# EAGLE design pcb_gift (EAGLE 8.2.2)
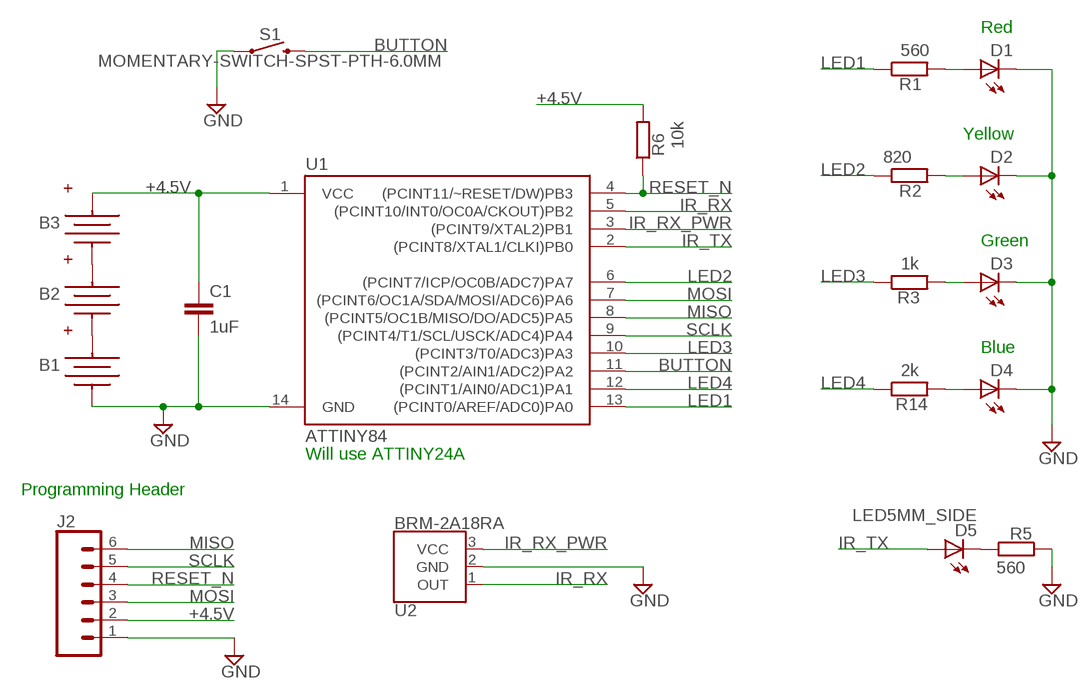
[diagram p0: schematic, sheet 1]

## Parts
B1  KEYSTONE_2996  [KEYSTONE_2996]
B2  KEYSTONE_2996  [KEYSTONE_2996]
B3  KEYSTONE_2996  [KEYSTONE_2996]
C1  1uF  C-EUC0805  [C0805]
D1  LED5MM  [LED5MM]
D2  LED5MM  [LED5MM]
D3  LED5MM  [LED5MM]
D4  LED5MM  [LED5MM]
D5  LED5MM_SIDE  [LED5MM_SIDE]
J2  CONN_061.27MM  [1X06_1.27MM]
R1  560  R-EU_R0805  [R0805]
R2  820  R-EU_R0805  [R0805]
R3  1k  R-EU_R0805  [R0805]
R5  560  R-EU_R0805  [R0805]
R6  10k  R-EU_R0805  [R0805]
R14  2k  R-EU_R0805  [R0805]
S1  MOMENTARY-SWITCH-SPST-PTH-6.0MM  [TACTILE_SWITCH_PTH_6.0MM]
U1  ATTINY84  [SO14]
U2  BRM-2A18RA  [BRM-2508]

## Nets
+4.5V: B3.POSA(POS) B3.POSB(POS) C1.1 J2.2 R6.2 U1.1(VCC)
BUTTON: S1.3 U1.11((PCINT2/AIN1/ADC2)PA2)
GND: B1.NEG C1.2 D1.K(C) D2.K(C) D3.K(C) D4.K(C) J2.1 R5.1 S1.1 U1.14(GND) U2.2(GND)
IR_RX: U1.5((PCINT10/INT0/OC0A/CKOUT)PB2) U2.1(OUT)
IR_RX_PWR: U1.3((PCINT9/XTAL2)PB1) U2.3(VCC)
IR_TX: D5.A U1.2((PCINT8/XTAL1/CLKI)PB0)
LED1: R1.1 U1.13((PCINT0/AREF/ADC0)PA0)
LED2: R2.1 U1.6((PCINT7/ICP/OC0B/ADC7)PA7)
LED3: R3.1 U1.10((PCINT3/T0/ADC3)PA3)
LED4: R14.1 U1.12((PCINT1/AIN0/ADC1)PA1)
MISO: J2.6 U1.8((PCINT5/OC1B/MISO/DO/ADC5)PA5)
MOSI: J2.3 U1.7((PCINT6/OC1A/SDA/MOSI/ADC6)PA6)
N$2: D1.A R1.2
N$3: B1.POSA(POS) B1.POSB(POS) B2.NEG
N$4: B2.POSA(POS) B2.POSB(POS) B3.NEG
N$7: D4.A R14.2
N$10: D3.A R3.2
N$13: D2.A R2.2
N$19: D5.K(C) R5.2
RESET_N: J2.4 R6.1 U1.4((PCINT11/~RESET/DW)PB3)
SCLK: J2.5 U1.9((PCINT4/T1/SCL/USCK/ADC4)PA4)

## Notes on the sheet
- Red
- Yellow
- Green
- Blue
- Will use ATTINY24A
- Programming Header

## Library data of the parts
B1-B3 = widget:KEYSTONE_2996
C1 = resistor:C-EU: CAPACITOR, European symbol
D1-D4 = widget:LED: Generic 5mm LED
D5 = widget:LED5MM_SIDE
J2 = widget:CONN_06: Multi connection point. Often used as Generic Header-pin footprint for 0.1 inch spaced/style header connections On any of the 0.1 inch spaced packages, you can populate with these: Break Away Headers - Straight <https://www.sparkfun.com/products/116> (PRT-00116) Break Away Male Headers - Right Angle <https://www.sparkfun.com/products/553> (PRT-00553) Female Headers <https://www.sparkfun.com/products/115> (PRT-00115) Break Away Headers - Machine Pin <https://www.sparkfun.com/products/117> (PRT-00117) Break Away Female Headers - Swiss Machine Pin <https://www.sparkfun.com/products/743> (PRT-00743) Arduino Stackable Header - 6 Pin <https://www.sparkfun.com/products/9280> (PRT-09280) For SCREWTERMINALS and SPRING TERMINALS visit here: Screw Terimnals on SparkFun.com <https://www.sparkfun.com/search/results?term=Screw+Terminals> (5mm/3.5mm/2.54mm spacing) This device is also useful as a general connection point to wire up your design to another part of your project. Our various solder wires solder well into these plated through hole pads. Hook-Up Wire - Assortment (Stranded, 22 AWG) <https://www.sparkfun.com/products/11375> (PRT-11375) Hook-Up Wire - Assortment (Solid Core, 22 AWG) <https://www.sparkfun.com/products/11367> (PRT-11367) View the entire wire category on our website here <https://www.sparkfun.com/categories/141>
R1-R3 R5 R6 R14 = resistor:R-EU_: RESISTOR, European symbol
S1 = SparkFun-Switches:MOMENTARY-SWITCH-SPST: Momentary Switch (Pushbutton) - SPST Normally-open (NO) SPST momentary switches (buttons, pushbuttons). Variants PTH-12MM - 12mm square, through-hole Momentary Pushbutton Switch - 12mm Square <https://www.sparkfun.com/products/9190> (COM-09190) PTH-6.0MM, PTH-6.0MM-KIT - 6.0mm square, through-hole Mini Pushbutton Switch <https://www.sparkfun.com/products/97> (COM-00097) KIT package intended for soldering kit's - only one side of pads' copper is exposed. PTH-RIGHT-ANGLE-KIT - Right-angle, through-hole Right Angle Tactile Button <https://www.sparkfun.com/products/10791> - Used on SparkFun BigTime Watch Kit <https://www.sparkfun.com/products/11734> SMD-12MM - 12mm square, surface-mount Tactile Button - SMD (12mm) <https://www.sparkfun.com/products/12993> (COM-12993) Used on SparkFun PicoBoard <https://www.sparkfun.com/products/11888> SMD-4.5MM - 4.5mm Square Trackball Switch Used on SparkFun Blackberry Trackballer Breakout <https://www.sparkfun.com/products/13169> SMD-4.6MMX2.8MM - 4.60mm x 2.80mm, surface mount Used on SparkFun SAMD21 Mini Breakout <https://www.sparkfun.com/products/13664> SMD-5.2MM, SMD-5.2-REDUNDANT - 5.2mm square, surface-mount Mini Pushbutton Switch - SMD <https://www.sparkfun.com/products/8720> (COM-08720) Used on Arduino Pro Mini <https://www.sparkfun.com/products/11114> REDUNDANT package connects both switch circuits together SMD-6.0X3.5MM - 6.0 x 3.5mm, surface mount Momentary Reset Switch SMD <https://www.sparkfun.com/products/8229> (COM-08229) SMD-6.2MM-TALL - 6.2mm square, surface mount Tactile Button - SMD (6mm) <https://www.sparkfun.com/products/12992> Used on SparkFun Digital Sandbox <https://www.sparkfun.com/products/12651> SMD-RIGHT-ANGLE - Right-angle, surface mount Used on SparkFun Block for Intel® Edison - Arduino <https://www.sparkfun.com/products/13036>; PROD_ID: SWCH-08441; SF_SKU: COM-00097
U1 = widget:ATTINY84: Atmel 14-pin 2/4/8kB flash uC Datasheet <https://cdn.sparkfun.com/datasheets/Widgets/doc8006.pdf> SparkFun Products Tiny AVR Programmer <https://www.sparkfun.com/products/11801> (PGM-11801) SparkFun Servo Trigger - Continuous Rotation <https://www.sparkfun.com/products/13872> (WIG-13872) SparkFun Servo Trigger <https://www.sparkfun.com/products/13118> (WIG-13118); PROD_ID: IC-11285
U2 = widget:BRM-2A18: BRM-2A18 IR Receiver The BRM-2A18 is miniaturized infrared receiver for remote control and other applications requiring improved ambient light rejection. Vertical package is a primary component on the ZX Distance and Gesture Sensor. RA package is not currently in-use. Example Datasheet <http://www.sinoskysun.com/upload/20110512/201105120447164615.PDF> SparkFun Products ZX Distance and Gesture Sensor <https://www.sparkfun.com/products/12780> (COM-12780)

## Board
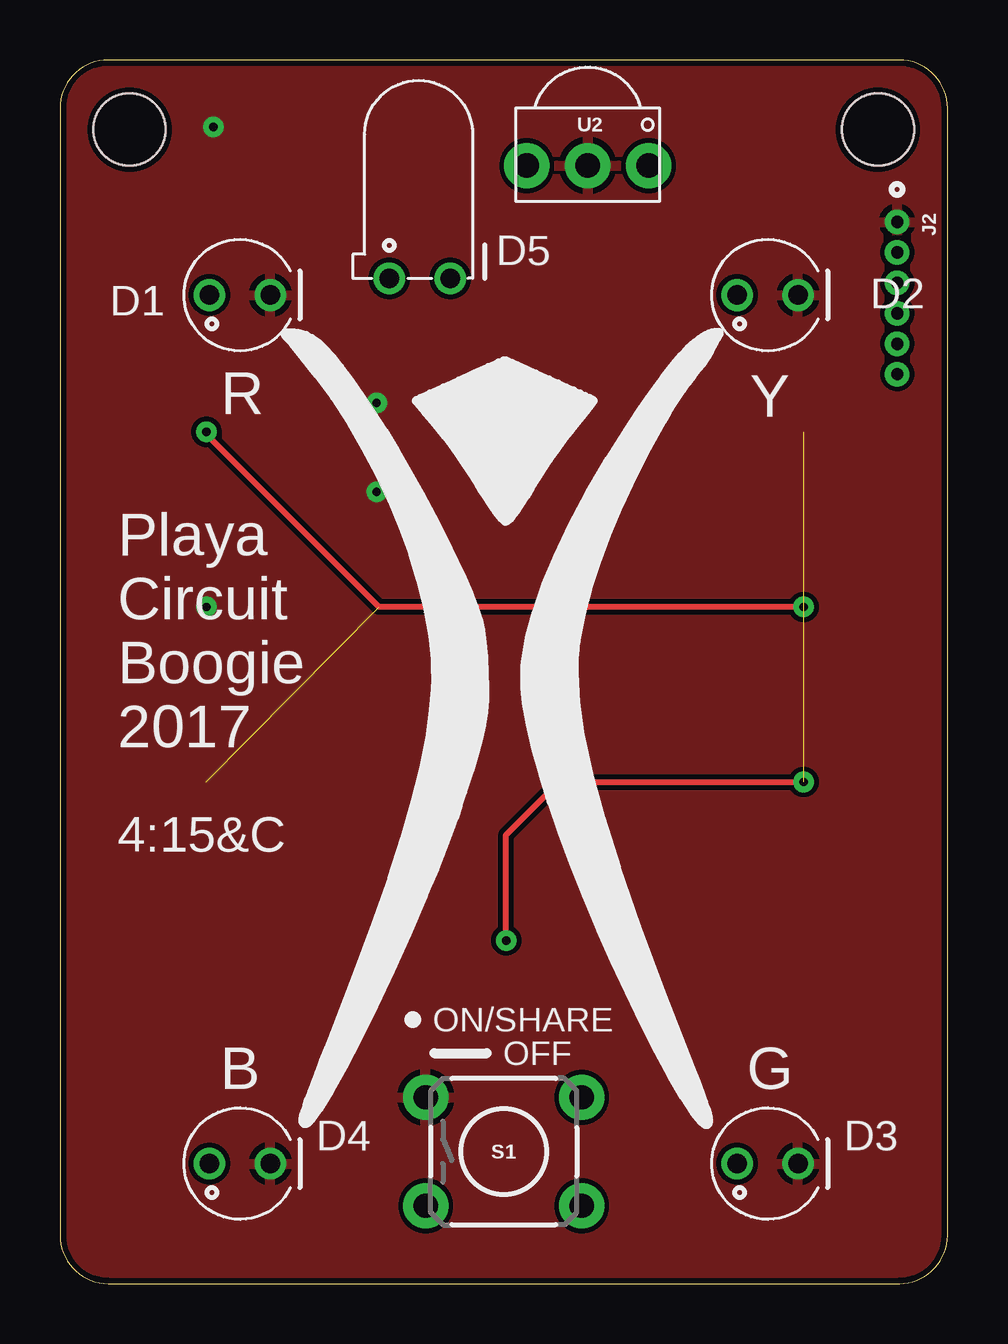
[diagram p1: board, top side]
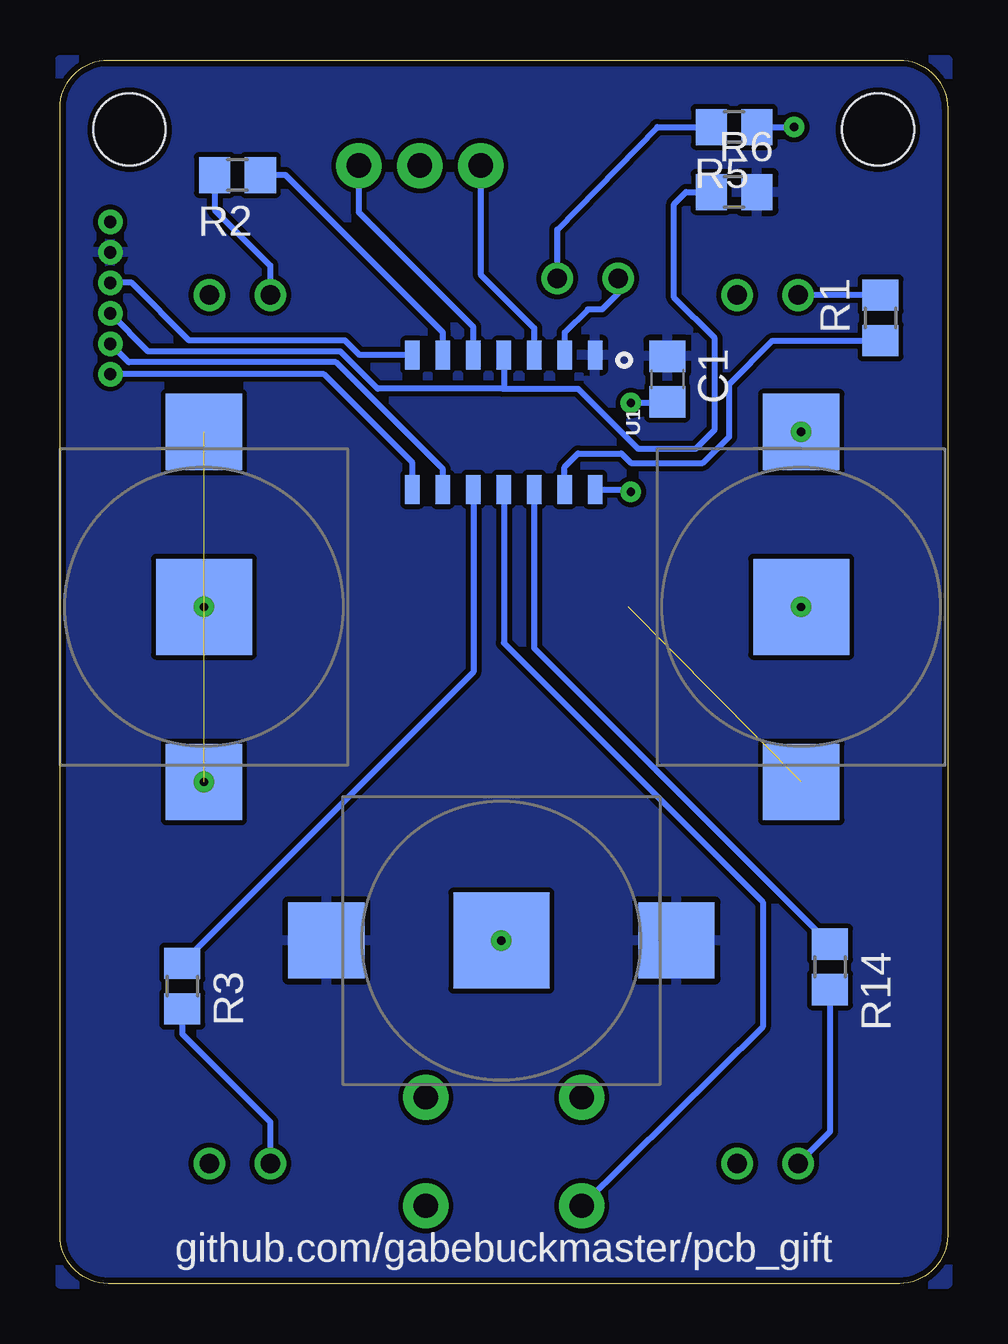
[diagram p2: board, bottom side, seen from below]

Size 37 x 51 mm. Coordinates in mm from the lower left corner, seen from the top.
Outline: 0,49 0,2 arc90 2,0 35,0 arc90 37,2 37,49 arc90 35,51 2,51 arc90 0,49
Copper layers (1*16): Top 0.035mm / dielectric 1.5mm / Bottom 0.035mm
Design rules "SparkFun *": minimum track width 8mil, minimum drill 20mil, track to track 8mil, track to pad 8mil, pad to pad 8mil, via to via 8mil, smd to smd 8mil, copper to edge 10mil, drill to drill 8mil, minimum pad ring 10mil, minimum via ring 10mil, stop-mask expansion 4mil, vias tented up to drill 25mil, thermal gap 10mil
Holes 3 mm at 34.1,48.1 2.9,48.1

### Footprints (pad centres in the part's own frame; a part is rotated, then mirrored left to right if it is on the bottom)
KEYSTONE_2996 = smd 4 x 4: NEG 0,0 | smd 3.18 x 3.18: POSA -7.295,0; POSB 7.295,0
C0805 = smd 1.3 x 1.5: 1 -0.95,0; 2 0.95,0
LED5MM = drill 0.813: A -1.27,0; K 1.27,0
LED5MM_SIDE = drill 0.813: A -1.27,0; K 1.27,0
1X06_1.27MM = drill 0.508 pad 1: 1 0,0; 2 1.27,0; 3 2.54,0; 4 3.81,0; 5 5.08,0; 6 6.35,0
R0805 = smd 1.3 x 1.5: 1 -0.95,0; 2 0.95,0
TACTILE_SWITCH_PTH_6.0MM = drill 1.016 pad 1.88: 1 -3.251,2.261; 2 3.251,2.261; 3 -3.251,-2.261; 4 3.251,-2.261
SO14 = smd 0.6 x 1.2: 1 -3.175,-2.8; 2 -1.905,-2.8; 3 -0.635,-2.8; 4 0.635,-2.8; 5 1.905,-2.8; 6 3.175,-2.8; 7 4.445,-2.8; 8 4.445,2.8; 9 3.175,2.8; 10 1.905,2.8; 11 0.635,2.8; 12 -0.635,2.8; 13 -1.905,2.8; 14 -3.175,2.8
BRM-2508 = drill 1.016 pad 1.88: 1 -2.54,0; 2 0,0; 3 2.54,0

### Placement (x,y rotation side)
B1  6.1,28.2 270 bottom
B2  31,28.2 270 bottom
B3  18.6,14.3 180 bottom
C1  11.68,37.7 270 bottom
D1  7.5,41.2 0 top
D2  29.5,41.2 0 top
D3  29.5,5 0 top
D4  7.5,5 0 top
D5  15,41.9 0 top
J2  34.9,44.25 270 top
R1  2.8,40.25 90 bottom
R2  29.6,46.2 180 bottom
R3  31.9,12.4 270 bottom
R5  8.9,48.2 180 bottom
R6  8.9,45.5 0 bottom
R14  4.9,13.2 270 bottom
S1  18.5,5.5 0 top
U1  17.86,35.9 180 bottom
U2  22,46.6 180 top

### Tracks (layer width: path | path; a pad name or v marks a point on that pad's centre or on a via)
+4.5V
  pour Bottom: 0,0 0,51 37,51 37,0
BUTTON
  Bottom 0.25: U1.11 18.5,26.7 7.7,15.9 7.7,10.69 S1.3
GND  (via drill 0.35)
  Bottom 0.25: C1.2 11.73,36.7 v13.2,36.7 | R5.1 v6.4,48.2 | U1.14 13.3,33.1 v13.2,33
  other vias: 6.1,28.2
  pour Top: 0,0 0,51 37,51 37,0
IR_RX
  Bottom 0.25: U1.5 19.77,39.87 24.54,44.64 U2.1
IR_RX_PWR
  Bottom 0.25: U1.3 17.23,39.83 19.46,42.06 U2.3
IR_TX
  Bottom 0.25: D5.A 13.73,41.27 14.4,40.6 15,40.6 15.96,39.64 U1.2
LED1
  Bottom 0.25: U1.13 15.96,34.04 15.4,34.6 13.6,34.6 13.2,34.2 10.2,34.2 9.1,35.3 9.1,37.5 7.3,39.3 R1.1
LED2
  Bottom 0.25: U1.6 21.04,39.64 27.6,46.2 R2.1
LED3
  Bottom 0.25: U1.10 19.77,25.48 R3.1
LED4
  Bottom 0.25: U1.12 17.23,26.48 R14.1
MISO
  Bottom 0.25: U1.8 22.31,34.21 26,37.9 J2.6
MOSI
  Bottom 0.25: U1.7 24.52,38.7 25.12,39.31 31.61,39.31 34.01,41.71 J2.3
N$2
  Bottom 0.25: R1.2 D1.A
N$3  (via drill 0.35)  (1 unrouted)
  Top 0.25: B2.NEG 13.3,28.2 6.1,35.4 B1.POSA
  other vias: 31,28.2 6.1,35.49
N$4  (via drill 0.35)  (1 unrouted)
  Top 0.25: B3.NEG 18.6,18.7 20.8,20.9 B2.POSB
  other vias: 18.6,14.3 31,20.91
N$7
  Bottom 0.25: R14.2 4.9,6.33 D4.A
N$10
  Bottom 0.25: R3.2 31.9,10.4 29.1,7.6 | 29.1,7.6 28.3,6.8 | 29.1,7.6 28.23,6.73 D3.A
N$13
  Bottom 0.25: R2.2 30.55,44.75 28.23,42.43 D2.A
N$19
  Bottom 0.25: D5.K 16.27,43.93 12.1,48.2 R5.2
RESET_N
  Bottom 0.25: 18.54,37.3 23.76,37.3 25.31,38.85 33.31,38.85 J2.4 | 18.54,37.3 15.4,37.3 12.9,34.8 10.5,34.8 9.7,35.6 9.7,39.4 11.4,41.1 11.4,45 10.9,45.5 R6.1 | U1.4 18.5,37.34 18.54,37.3
SCLK
  Bottom 0.25: U1.9 21.04,33.94 25.5,38.4 34.13,38.4 J2.5

### Text on the board
bPlace: github.com/gabebuckmaster/pcb_gift
tSilk: R | Y | Playa / Circuit / Boogie / 2017 | 4:15&C | ON/SHARE | OFF | B | G